# Altium project EDU_1.PrjPcb
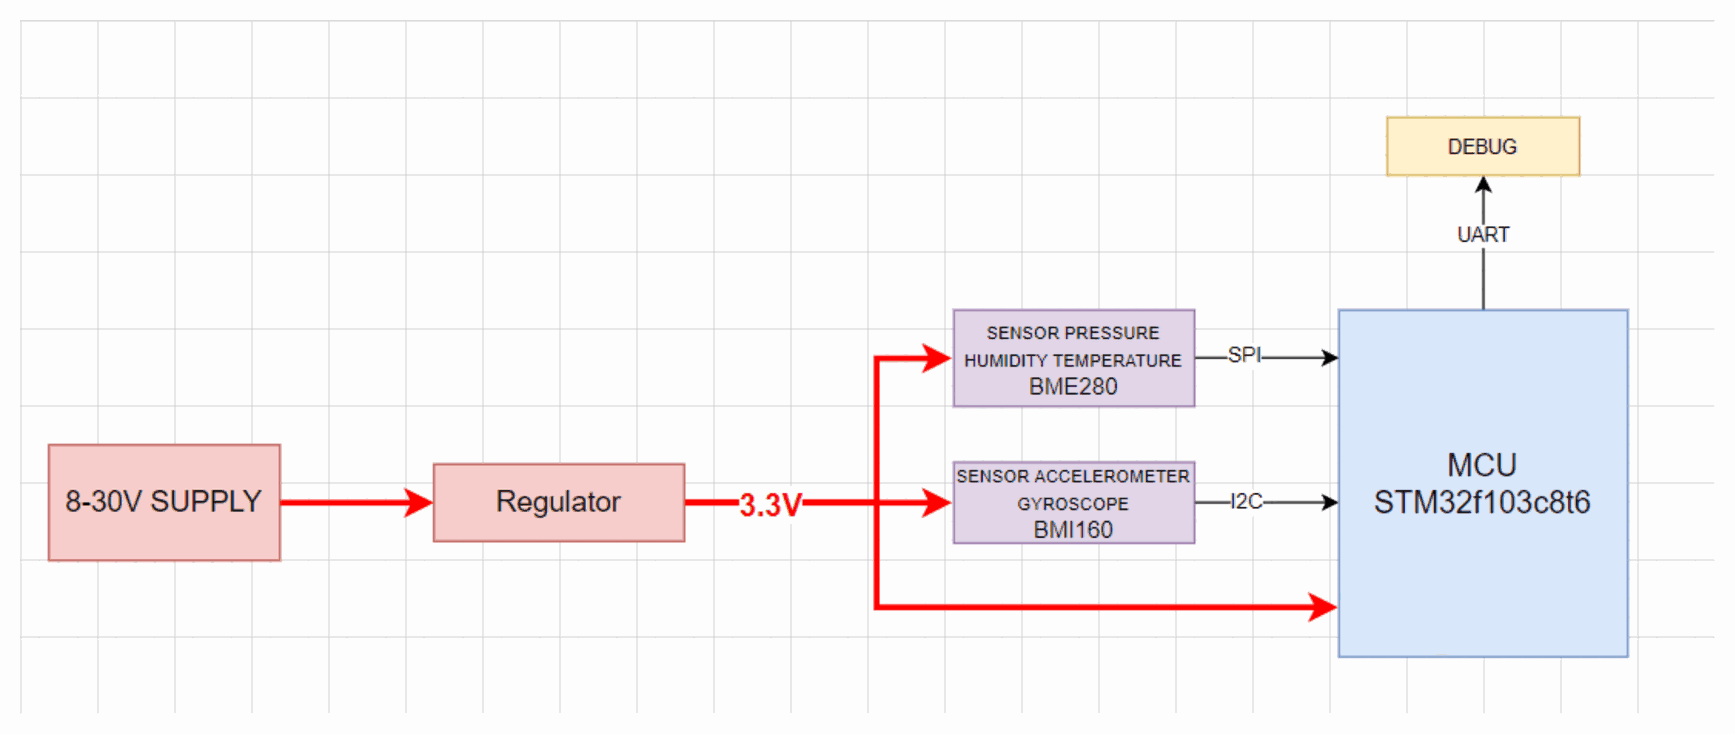
[diagram p0: Block Diagram.SchDoc]
3 sheets, 60 parts. Net scope: global (net labels, ports and power ports of the same name join across sheets).
Board file: PCB.PcbDoc
Sheets:
  Block Diagram.SchDoc
  Power Tree.SchDoc
  Schematics.SchDoc

## Sheet Block Diagram.SchDoc
size A3; Date: 12.10.2022; ApprovedBy: Alper Oğan; CompanyName: Soar Robotics; DrawnBy: Sude Yıkılmaz; Revision: v1r1; SheetNumber: 2; SheetTotal: 4

### Notes on the sheet
- Drawing Title:
- Drawn by:
- Approved By:
- Size:
- Sheet Title:
- Document Number:
- Revision:
- Date:
- Sheet:
- of

## Sheet Power Tree.SchDoc
size A3; SheetNumber: 2; SheetTotal: 3

### Notes on the sheet
- Drawing Title:
- Drawn by:
- Approved By:
- Size:
- Sheet Title:
- Document Number:
- Revision:
- Date:
- Sheet:
- of
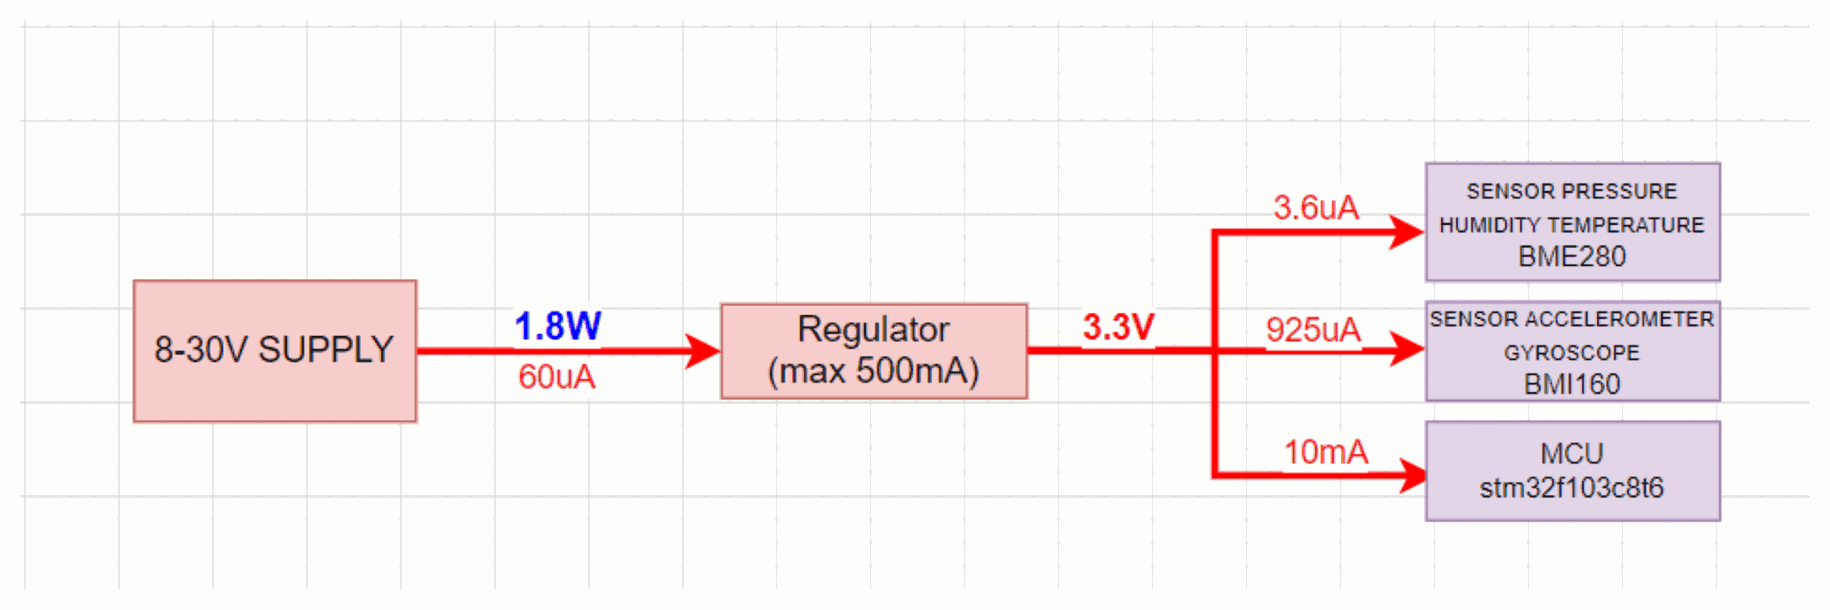
[diagram p1: Power Tree.SchDoc]

## Sheet Schematics.SchDoc
size A3; SheetNumber: 4; SheetTotal: 4
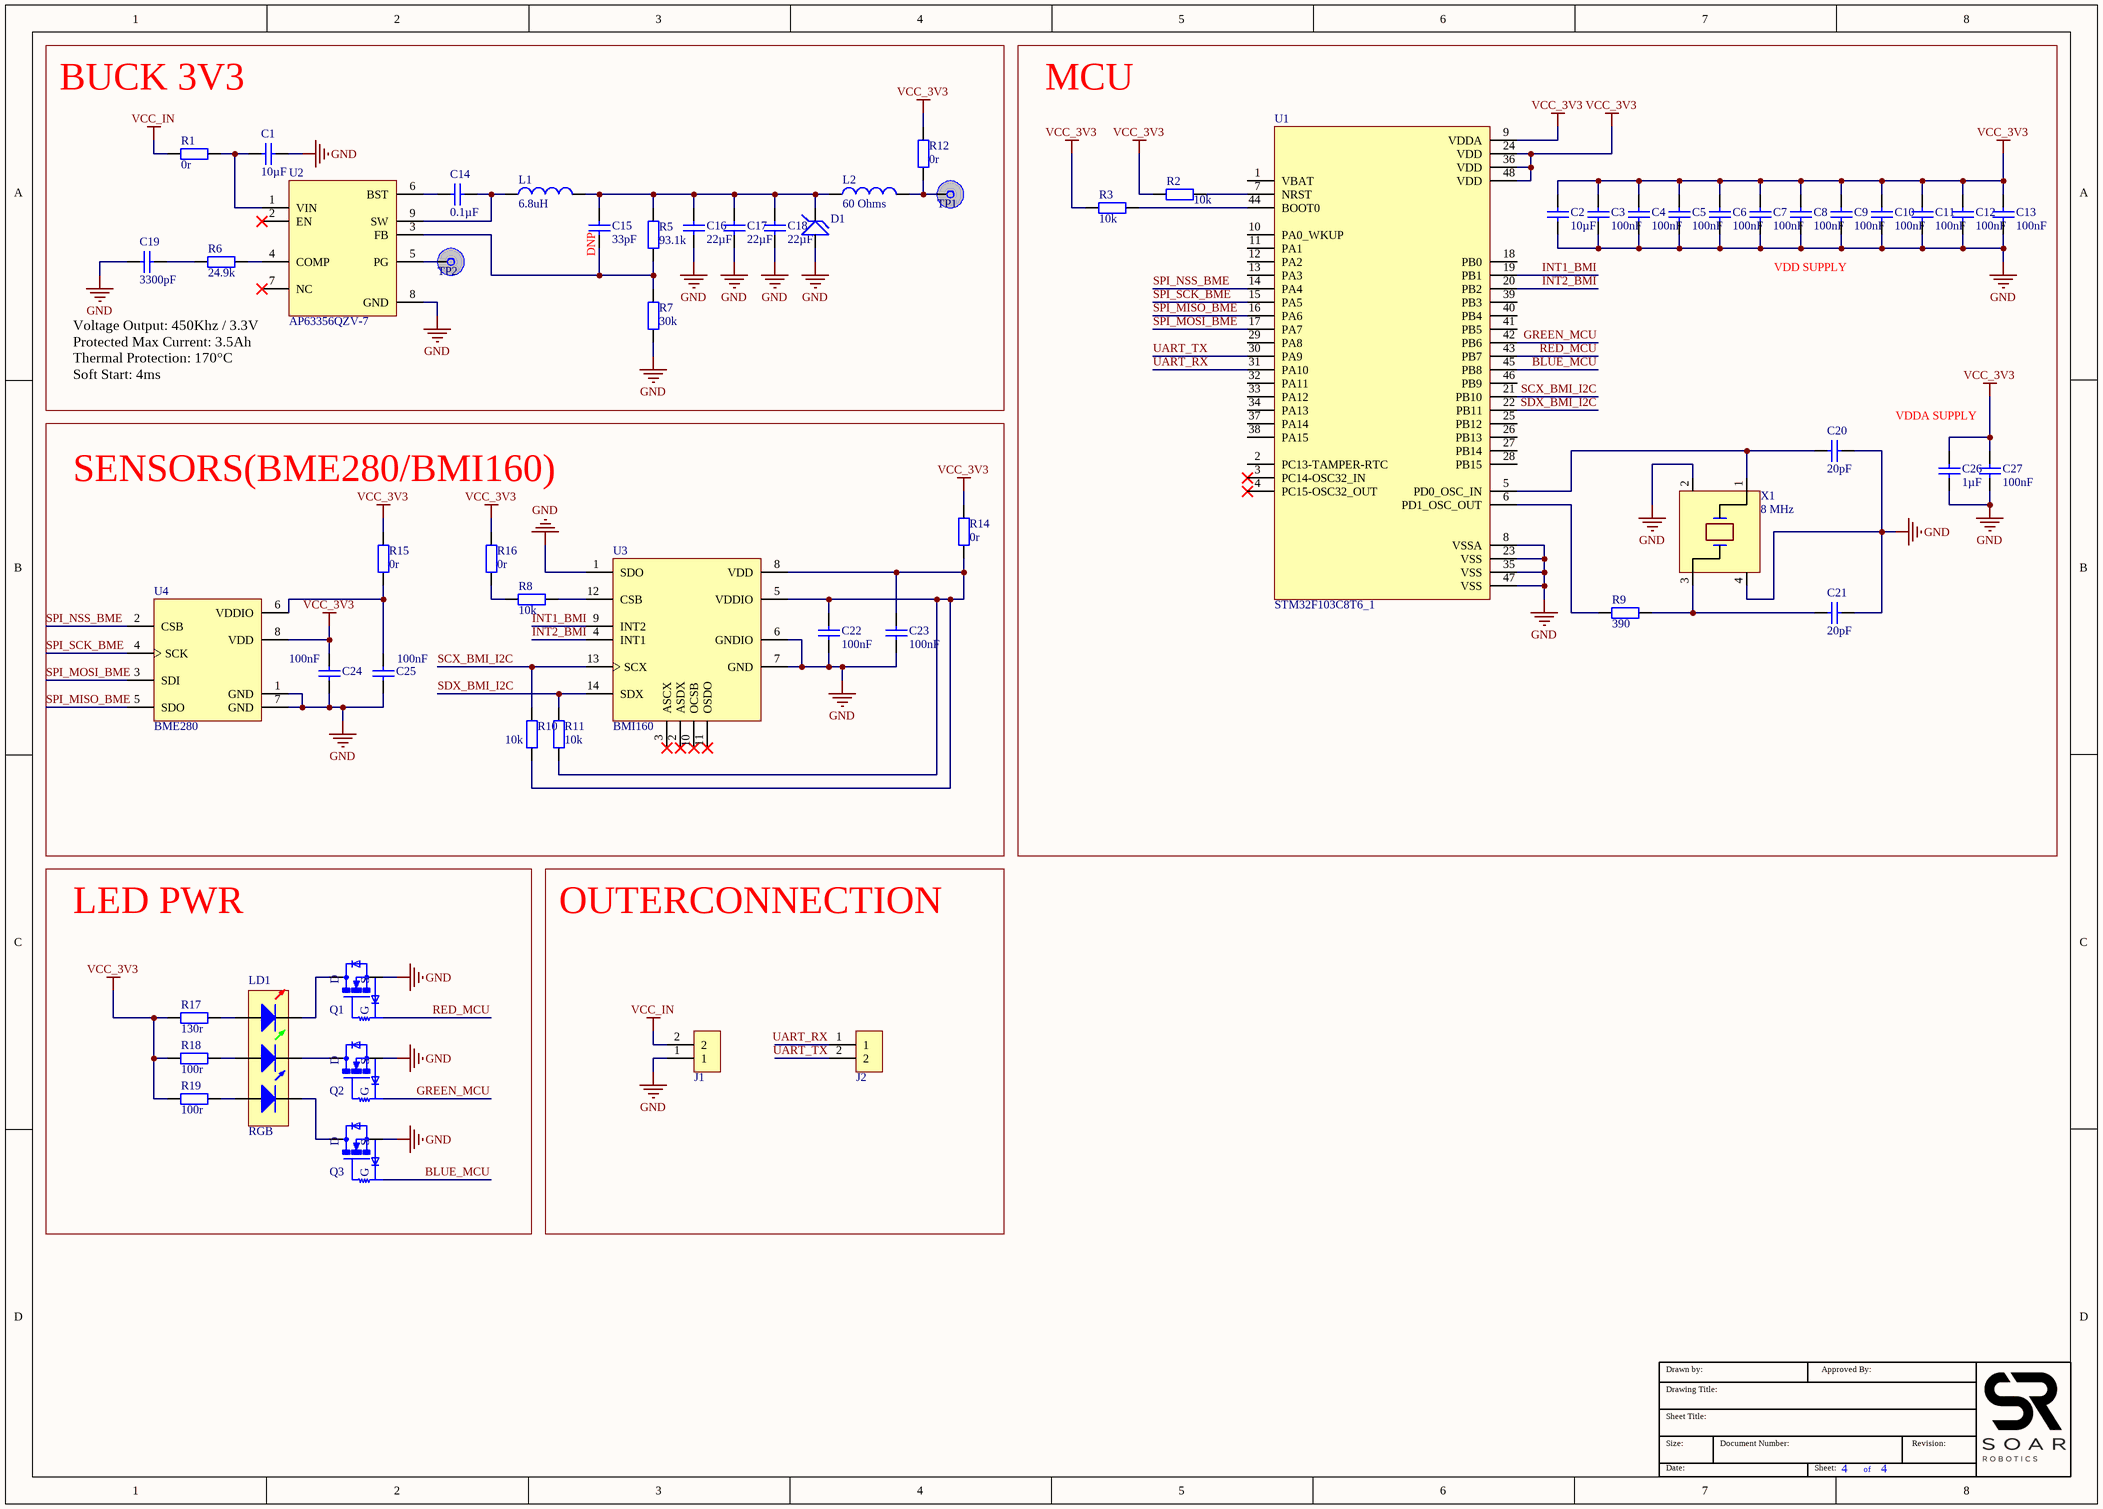
[diagram p2: Schematics.SchDoc]

### Parts
C1  value 10µF  [CAP_0805]  (hidden comment: GRM21BR61H106KE43L)
C2  value 10µF  [CAP_0402]  (hidden comment: GRJ155R60J106ME11D)
C3  value 100nF  [CAP_0603]  (hidden comment: CAP)
C4  value 100nF  [CAP_0603]  (hidden comment: CAP)
C5  value 100nF  [CAP_0603]  (hidden comment: CAP)
C6  value 100nF  [CAP_0603]  (hidden comment: CAP)
C7  value 100nF  [CAP_0603]  (hidden comment: CAP)
C8  value 100nF  [CAP_0603]  (hidden comment: CAP)
C9  value 100nF  [CAP_0603]  (hidden comment: CAP)
C10  value 100nF  [CAP_0603]  (hidden comment: CAP)
C11  value 100nF  [CAP_0603]  (hidden comment: CAP)
C12  value 100nF  [CAP_0603]  (hidden comment: CAP)
C13  value 100nF  [CAP_0603]  (hidden comment: CAP)
C14  value 0.1µF  [CAP_0402]  (hidden comment: 04025C104KAT2A)
C15  value 33pF  [CAP_0402]  (hidden comment: CL05C330JB5NNNC)
C16  value 22µF  [CAP_0603]  (hidden comment: GRM188R60J226MEA0D)
C17  value 22µF  [CAP_0603]  (hidden comment: GRM188R60J226MEA0D)
C18  value 22µF  [CAP_0603]  (hidden comment: GRM188R60J226MEA0D)
C19  value 3300pF  [CAP_0402]  (hidden comment: CL05B332KB5NNNC)
C20  value 20pF  [CAP_0402]  (hidden comment: CC0402GRNPO9BN200)
C21  value 20pF  [CAP_0402]  (hidden comment: CC0402GRNPO9BN200)
C22  value 100nF  [CAP_0603]  (hidden comment: CAP)
C23  value 100nF  [CAP_0603]  (hidden comment: CAP)
C24  value 100nF  [CAP_0603]  (hidden comment: CAP)
C25  value 100nF  [CAP_0603]  (hidden comment: CAP)
C26  value 1µF  [CAP_0805]  (hidden comment: CL21B105KAFNFNE)
C27  value 100nF  [CAP_0603]  (hidden comment: CAP)
D1  D6V3H1U2LP16-7  [U-DFN1610-2]  (value not drawn)
J1  PRPC001DAAN-RC  [Header x2 Through Hole]  (value not drawn)
J2  M50-3630242  [1.27MM 2X1 HEADER]  (value not drawn)
L1  value 6.8uH  [74439346068]  (hidden comment: 74439346068)
L2  value 60 Ohms  [IND_0805]  (hidden comment: BLM21PG600SH1D)
LD1  Color: RGB  [SMD-RGB(1.60x1.60)]  (hidden comment: EAST1616RGBB8)
Q1  CSD13381F4  [3-XFDFN]  (value not drawn)
Q2  CSD13381F4  [3-XFDFN]  (value not drawn)
Q3  CSD13381F4  [3-XFDFN]  (value not drawn)
R1  value 0r  [RES_0402]  (hidden comment: RC0402JR-070RL)
R2  value 10k  [RES_0402]  (hidden comment: RMCF0402FT10K0)
R3  value 10k  [RES_0402]  (hidden comment: RMCF0402FT10K0)
R5  value 93.1k  [RES_0402]  (hidden comment: RC0402FR-0793K1L)
R6  value 24.9k  [RES_0402]  (hidden comment: RMCF0402FT24K9)
R7  value 30k  [RES_0402]  (hidden comment: RC0402FR-0730KL)
R8  value 10k  [RES_0402]  (hidden comment: RMCF0402FT10K0)
R9  value 390  [RES_0402]  (hidden comment: RC0402FR-07390RL)
R10  value 10k  [RES_0402]  (hidden comment: RMCF0402FT10K0)
R11  value 10k  [RES_0402]  (hidden comment: RMCF0402FT10K0)
R12  value 0r  [RES_0402]  (hidden comment: RC0402JR-070RL)
R14  value 0r  [RES_0402]  (hidden comment: RC0402JR-070RL)
R15  value 0r  [RES_0402]  (hidden comment: RC0402JR-070RL)
R16  value 0r  [RES_0402]  (hidden comment: RC0402JR-070RL)
R17  value 130r  [RES_0402]  (hidden comment: RC0402JR-07130RL)
R18  value 100r  [RES_0402]  (hidden comment: RC0402FR-07100RL)
R19  value 100r  [RES_0402]  (hidden comment: RC0402FR-07100RL)
TP1  TP  [TP]  (value not drawn)  (no BOM)
TP2  TP  [TP]  (value not drawn)  (no BOM)
U1  STM32F103C8T6_1  [QFP50P900X900X160-48N]
U2  AP63356QZV-7  [V-DFN3020-13]
U3  BMI160  [PQFN50P250X300X88-14N]
U4  BME280  [PSON65P250X250X100-8N]
X1  value 8 MHz  [XTAL_ECS-240-8-33-AGN-TR]  (hidden comment: ECS-80-12-33-JGN-TR)

### Blocks framed on the sheet
BUCK 3V3: C1 C14-C19 D1 L1 L2 R1 R5-R7 R12 TP1 TP2 U2
MCU: C2-C13 C20 C21 C26 C27 R2 R3 R9 U1 X1
SENSORS(BME280/BMI160): C22-C25 R8 R10 R11 R14-R16 U3 U4
LED PWR: LD1 Q1-Q3 R17-R19
OUTERCONNECTION: J1 J2

### Nets
GND: C1.1 C2.1 C3.2 C4.2 C5.2 C6.2 C7.2 C8.2 C9.2 C10.2 C11.2 C12.2 C13.2 C16.1 C17.1 C18.1 C19.1 C20.2 C21.2 C22.2 C23.2 C24.1 C25.1 C26.1 C27.2 D1.1 J1.1 Q1.2(S) Q2.2(S) Q3.2(S) R7.1 U1.8(VSSA) U1.23(VSS) U1.35(VSS) U1.47(VSS) U2.8(GND) U3.1(SDO) U3.6(GNDIO) U3.7(GND) U4.1(GND) U4.7(GND) X1.2 X1.4
VCC_3V3: C2.2 C3.1 C4.1 C5.1 C6.1 C7.1 C8.1 C9.1 C10.1 C11.1 C12.1 C13.1 C24.2 C26.2 C27.1 R2.1 R3.2 R12.2 R14.2 R15.2 R16.2 R17.1 R18.1 R19.1 U1.9(VDDA) U1.24(VDD) U1.36(VDD) U1.48(VDD) U4.8(VDD)
VCC_IN: J1.2 R1.1
BLUE_MCU: Q3.1(G) U1.45(PB8)
GREEN_MCU: Q2.1(G) U1.42(PB6)
INT1_BMI: U1.19(PB1) U3.9(INT2)
INT2_BMI: U1.20(PB2) U3.4(INT1)
RED_MCU: Q1.1(G) U1.43(PB7)
SCX_BMI_I2C: R10.2 U1.21(PB10) U3.13(SCX)
SDX_BMI_I2C: R11.2 U1.22(PB11) U3.14(SDX)
SPI_MISO_BME: U1.16(PA6) U4.5(SDO)
SPI_MOSI_BME: U1.17(PA7) U4.3(SDI)
SPI_NSS_BME: U1.14(PA4) U4.2(CSB)
SPI_SCK_BME: U1.15(PA5) U4.4(SCK)
UART_RX: J2.1 U1.31(PA10)
UART_TX: J2.2 U1.30(PA9)
NetC1_2: C1.2 R1.2 U2.1(VIN)
NetC14_1: C14.1 L1.1 U2.9(SW)
NetC14_2: C14.2 U2.6(BST)
NetC15_1: C15.1 R5.1 R7.2 U2.3(FB)
NetC15_2: C15.2 C16.2 C17.2 C18.2 D1.2 L1.2 L2.1 R5.2
NetC19_2: C19.2 R6.1
NetC20_1: C20.1 U1.5(PD0_OSC_IN) X1.1
NetC21_1: C21.1 R9.2 X1.3
NetC22_1: C22.1 C23.1 R10.1 R11.1 R14.1 U3.5(VDDIO) U3.8(VDD)
NetC25_2: C25.2 R15.1 U4.6(VDDIO)
NetL2_2: L2.2 R12.1 TP1.1
NetLD1_1: LD1.1(GC) Q2.3(D)
NetLD1_2: LD1.2(GA) R18.2
NetLD1_3: LD1.3(RC) Q1.3(D)
NetLD1_4: LD1.4(RA) R17.2
NetLD1_5: LD1.5(BC) Q3.3(D)
NetLD1_6: LD1.6(BA) R19.2
NetR2_2: R2.2 U1.7(NRST)
NetR3_1: R3.1 U1.44(BOOT0)
NetR6_2: R6.2 U2.4(COMP)
NetR8_1: R8.1 U3.12(CSB)
NetR8_2: R8.2 R16.1
NetR9_1: R9.1 U1.6(PD1_OSC_OUT)
NetTP2_1: TP2.1 U2.5(PG)

Not connected (* = marked no-connect by the designer): U1 1(VBAT) 2(PC13-TAMPER-RTC) 3(PC14-OSC32_IN)* 4(PC15-OSC32_OUT)* 10(PA0_WKUP) 11(PA1) 12(PA2) 13(PA3) 18(PB0) 25(PB12) 26(PB13) 27(PB14) 28(PB15) 29(PA8) 32(PA11) 33(PA12) 34(PA13) 37(PA14) 38(PA15) 39(PB3) 40(PB4) 41(PB5) 46(PB9); U2 2(EN)* 7(NC)*; U3 2(ASDX)* 3(ASCX)* 10(OCSB)* 11(OSDO)*

### Notes on the sheet
- (near C15) DNP
- VDD SUPPLY
- (near U2) Voltage Output: 450Khz / 3.3V
  Protected Max Current: 3.5Ah
  Thermal Protection: 170°C
  Soft Start: 4ms
- VDDA SUPPLY
- Drawing Title:
- Drawn by:
- Approved By:
- Size:
- Sheet Title:
- Document Number:
- Revision:
- Date:
- Sheet:
- of

### Library data of the parts
C1 = GRM21BR61H106KE43L: 10 µF ±10% 50V Ceramic Capacitor X5R 0805 (2012 Metric); Manufacturer Part Number: GRM21BR61H106KE43L; Voltage: 50V; Tolerance: ±10%; Price@1: $0.36000; Price@1000: $0.09614; Link: https://www.digikey.com/en/products/detail/murata-electronics/GRM21BR61H106KE43L/10326316; Package: 0805
C2 = GRJ155R60J106ME11D: 10µF ±20% 6.3V Ceramic Capacitor X5R 0402 (1005 Metric); Tolerance: %20; Manufacturer Part Number: GRJ155R60J106ME11D; Voltage: 6.3V; Price@1: $0.21000; Price@1000: $0.04436; Link: https://www.digikey.com/product-detail/en/murata-electronics/GRJ155R60J106ME11D/490-13211-1-ND/5877419; Package: 0402
C14 = 04025C104KAT2A: 0.1 µF ±10% 50V Ceramic Capacitor X7R 0402 (1005 Metric); Tolerance: %10; Manufacturer Part Number: 04025C104KAT2A; Voltage: 50V; Price@1: $0.10000; Price@1000: $0.01664; Link: https://www.digikey.com/en/products/detail/kyocera-avx/04025C104KAT2A/6564238; Package: 0402
C15 = CL05C330JB5NNNC: 33pF ±5% 50V Ceramic Capacitor C0G, NP0 0402 (1005 Metric); Tolerance: %5; Manufacturer Part Number: CL05C330JB5NNNC; Voltage: 50V; Price@1: $0.10000; Price@1000: $0.00626; Link: https://www.digikey.com/en/products/detail/samsung-electro-mechanics/CL05C330JB5NNNC/3886930; Package: 0402
C16-C18 = GRM188R60J226MEA0D: 22 µF ±20% 6.3V Ceramic Capacitor X5R 0603 (1608 Metric); Tolerance: %20; Manufacturer Part Number: GRM188R60J226MEA0D; Voltage: 6.3V; Price@1: $0.24000; Price@1000: $0.05026; Link: https://www.digikey.com/en/products/detail/murata-electronics/GRM188R60J226MEA0D/4280542; Package: 0603
C19 = CL05B332KB5NNNC: 3300pF ±10% 50V Ceramic Capacitor X7R 0402 (1005 Metric); Tolerance: %10; Manufacturer Part Number: CL05B332KB5NNNC; Voltage: 50V; Price@1: $0.10000; Price@1000: $0.00672; Link: https://www.digikey.com/en/products/detail/samsung-electro-mechanics/CL05B332KB5NNNC/3887210; Package: 0402
C20 C21 = CC0402GRNPO9BN200: 20pF ±2% 50V Ceramic Capacitor C0G, NP0 0402 (1005 Metric); Tolerance: %2; Manufacturer Part Number: CC0402GRNPO9BN200; Voltage: 50v; Price@1: $0.10000; Price@1000: $0.01724; Link: https://www.digikey.com/en/products/detail/yageo/CC0402GRNPO9BN200/5195060; Package: 0402
C26 = CL21B105KAFNFNE: 1µF ±10% 25V Ceramic Capacitor X7R 0805 (2012 Metric); Tolerance: %10; Manufacturer Part Number: CL21B105KAFNFNE; Voltage: 25V; Price@1: $0.10000; Price@1000: $0.01828; Link: https://www.digikey.com/en/products/detail/samsung-electro-mechanics/CL21B105KAFNFNE/3888584; Package: 0805
D1 = D6V3H1U2LP16-7: TVS DIODE 6.3V 11.5V U-DFN1610-2; Manufacturer Part Number: D6V3H1U2LP16-7; Price@1: $0.42000; Price@1000: $0.09021; Link: https://www.digikey.com/en/products/detail/diodes-incorporated/D6V3H1U2LP16-7/6187238?s=N4IgjCBcpgbFoDGUBmBDANgZwKYBoQB7KAbRAGYBOAJgFZ4BdAgBwBcoQBlVgJwEsAdgHMQAXwJgAHOQQhkkdNnxFSIACzVytcoxbtIXXoJHiQAdlgRoc1JlwFikMnWph6IJiDYdu-YWIlKSUpZeUV7FScQAAYPPR8jf1MAWmpQqF4AV2VHMloQAhDPbwMxU3hrPgATDmSwaIh40oIAR1YATw5GkA7mHA40LGRRUSA
J1 = PRPC001DAAN-RC: Connector Header Through Hole 2 position  2.54mm; Manufacturer Part Number: PRPC001DAAN-RC; Price@1: $0.08000; Price@1000: $0.03716; Link: https://www.digikey.com/en/products/detail/sullins-connector-solutions/PRPC001DAAN-RC/2775293
J2 = M50-3630242: Connector Header Surface Mount 2 position 0.050" (1.27mm); Manufacturer Part Number: M50-3630242; Price@1: $0.27000; Price@1000: $0.14785; Link: https://www.digikey.com/en/products/detail/harwin-inc/M50-3630242/7044021
L1 = 74439346068: 6.8 µH Shielded Drum Core, Wirewound Inductor 6.5 A 17.6mOhm Nonstandard; Link: https://www.digikey.com/en/products/detail/w%C3%BCrth-elektronik/74439346068/6236304?s=N4IgTCBcDaIOwBYEGYCcyEDYAMmAcIAugL5A; Price@1000: $2.25601; Manufacturer Part Number: 74439346068; Price@1: $4.05000
L2 = BLM21PG600SH1D: 60 Ohms @ 100MHz 1 Power Line Ferrite Bead 0805 (2012 Metric) 3.5A 20mOhm; Link: https://www.arrow.com/en/products/blm21pg600sh1d/murata-manufacturing?region=nac&utm_campaign=octopart_2022&utm_content=inv_listing&utm_currency=USD&utm_keyword=BLM21PG600SH1D&utm_medium=aggregator&utm_source=octopart; Price@1: $0.1647; Price@1000: $0.0611; Manufacturer Part Number: BLM21PG600SH1D
LD1 = EAST1616RGBB8: Red, Green, Blue (RGB) 624nm Red, 530nm Green, 465nm Blue LED Indication - Discrete 2.05V Red, 2.2V Green, 2.2V Blue 0606 (1616 Metric); Manufacturer Part Number: EAST1616RGBB8; Link: https://www.digikey.com/en/products/detail/everlight-electronics-co-ltd/EAST1616RGBB8/11560358?s=N4IgjCBcoMwOxVAYygMwIYBsDOBTANCAPZQDaIMAnAKwwBsMIAuoQA4AuUIAyuwE4BLAHYBzEAF9CMMJUQgUkDDgLEyIACzqYADjDbmbTpB79hYySAC0dOQv4BXFSUjkATAZAcuEwpffR5KAcnNVlCag8vYwkLGwCBABMuSzAABghDb0IAR3YATy4MkHzWXC50bBRxcSA; Price@1000: $0.13356; Price@1: $0.48000; Voltage: 2.05V Red, 2.2V Green, 2.2V Blue
Q1-Q3 = CSD13381F4: N-Channel 12 V 2.1A (Ta) 500mW (Ta) Surface Mount 3-PICOSTAR; Manufacturer Part Number: CSD13381F4; Price@1: $0.64000; Link: https://www.digikey.com/en/products/detail/texas-instruments/CSD13381F4/4437947; Price@1000: $0.13708
R1 R12 R14-R16 = RC0402JR-070RL: RES SMD 0 OHM JUMPER 1/16W 0402; Tolerance: %0; Manufacturer Part Number: RC0402JR-070RL; Power: 1/16w; Price@1: $0.10000; Price@1000: $0.00236; Link: https://www.digikey.com/product-detail/en/yageo/RC0402JR-070RL/311-0-0JRCT-ND/729353; Package: 0402
R2 R3 R8 R10 R11 = RMCF0402FT10K0: RES 10K OHM 1% 1/16W 0402; Tolerance: %1; Package: 0402; Price@1000: $0.00274; Price@1: $0.10000; Power: 1/16w; Manufacturer Part Number: RMCF0402FT10K0; Link: https://www.digikey.com/en/products/detail/stackpole-electronics-inc/RMCF0402FT10K0/1761433
R5 = RC0402FR-0793K1L: 93.1 kOhms ±1% 0.063W, 1/16W Chip Resistor 0402 (1005 Metric) Moisture Resistant Thick Film; Tolerance: %1; Manufacturer Part Number: RC0402FR-0793K1L; Power: 1/16w; Price@1: $0.10000; Price@1000: $0.00286; Link: https://www.digikey.com/en/products/detail/yageo/RC0402FR-0793K1L/5281120; Package: 0402
R6 = RMCF0402FT24K9: RES 24.9K OHM 1% 1/16W 0402; Tolerance: %1; Manufacturer Part Number: RMCF0402FT24K9; Power: 1/16W; Price@1: $0.10000; Link: https://www.digikey.com/en/products/detail/stackpole-electronics-inc/RMCF0402FT24K9/1714571; Price@1000: $0.00274; Package: 0402
R7 = RC0402FR-0730KL: RES SMD 30K OHM 1% 1/16W 0402; Tolerance: %1; Manufacturer Part Number: RC0402FR-0730KL; Power: 1/16w; Price@1: $0.10000; Price@1000: $0.00260; Link: https://www.digikey.com/en/products/detail/yageo/RC0402FR-0730KL/726586; Package: 0402
R9 = RC0402FR-07390RL: 390 Ohms ±1% 0.063W, 1/16W Chip Resistor 0402 (1005 Metric) Moisture Resistant Thick Film; Manufacturer Part Number: RC0402FR-07390RL; Power: 1/16W; Price@1: 0.1; Price@1000: $0.00267; Tolerance: ±1%; Package: 0402; Link: https://www.digikey.com/en/products/detail/yageo/RC0402FR-07390RL/2827613
R17 = RC0402JR-07130RL: RES SMD 130 OHM 5% 1/16W 0402; Tolerance: %5; Manufacturer Part Number: RC0402JR-07130RL; Power: 1/16w; Price@1: $0.10000; Price@1000: $0.00236; Link: https://www.digikey.com/product-detail/en/yageo/RC0402JR-07130RL/311-130JRCT-ND/2827976; Package: 0402
R18 R19 = RC0402FR-07100RL: RES SMD 100 OHM 1% 1/16W 0402; Tolerance: %1; Manufacturer Part Number: RC0402FR-07100RL; Power: 1/16w; Price@1: $0.10000; Price@1000: $0.00289; Link: https://www.digikey.com/product-detail/en/yageo/RC0402FR-07100RL/311-100LRCT-ND/729474; Package: 0402
TP1 TP2 = TP: Test Point
U1 = STM32F103C8T6_1: Mainstream Performance line, ARM Cortex-M3 MCU with 64 Kbytes Flash, 72 MHz CPU, motor control, USB and CAN; Price@1000: $4.67880; Link: https://www.digikey.com/en/products/detail/stmicroelectronics/STM32F103C8T6/1646338; Price@1: $7.64; Manufacturer Part Number: STM32F103C8T6
U2 = AP63356QZV-7: Buck Switching Regulator IC Positive Adjustable 0.8V 1 Output 3.5A 13-PowerVFDFN; Manufacturer Part Number: AP63356QZV-7; Price@1: $1.27000; Price@1000: $0.57749; Link: https://www.digikey.com/en/products/detail/diodes-incorporated/AP63356QZV-7/13543596?s=N4IgTCBcDaIIIAUBsBmFBWJBFAWgNQFoB2EAXQF8g
U3 = BMI160: Accelerometer, Gyroscope, 6 Axis Sensor IÂ²C, SPI Output; Price@1000: None; Price@1: None; Link: https://www.digikey.com/en/products/detail/bosch-sensortec/BMI160/6136300; Manufacturer Part Number: BMI160
U4 = BME280: DIGITAL HUMIDITY, PRESSURE AND TEMPERATURE SENSOR<br>* Digital interface IÂ²C (up to 3.4 MHz) and SPI (3 and 4 wire, up to 10 MHz)* Supply voltage VDD main supply voltage range: 1.71 V to 3.6 V*VDDIO interface voltage range: 1.2 V to 3.6 V<br> Operating range -40â€¦+85 Â°C, 0â€¦100 % rel. humidity, 300â€¦1100 hPa <br><br>  The library has been designed by<a href="https://www.facebook.com/groups/eaglecadsoftUK"> Richard Magdycz</a>; Price@1: $9.01; Price@100: $4.90250; Link: https://www.digikey.com/en/products/detail/bosch-sensortec/BME280/6136306; Manufacturer Part Number: BME280
X1 = ECS-80-12-33-JGN-TR: 8 MHz ±20ppm Crystal 12pF 400 Ohms 4-SMD, No Lead; Manufacturer Product Number: ECS-80-12-33-JGN-TR; Link: https://www.digikey.com/en/products/detail/ecs-inc/ECS-80-12-33-JGN-TR/10478754; Price@1: 0.66000; Price@1000: 0.45450